# EAGLE design source_eagle (EAGLE 9.4.1)
AUTHOR: ladyada
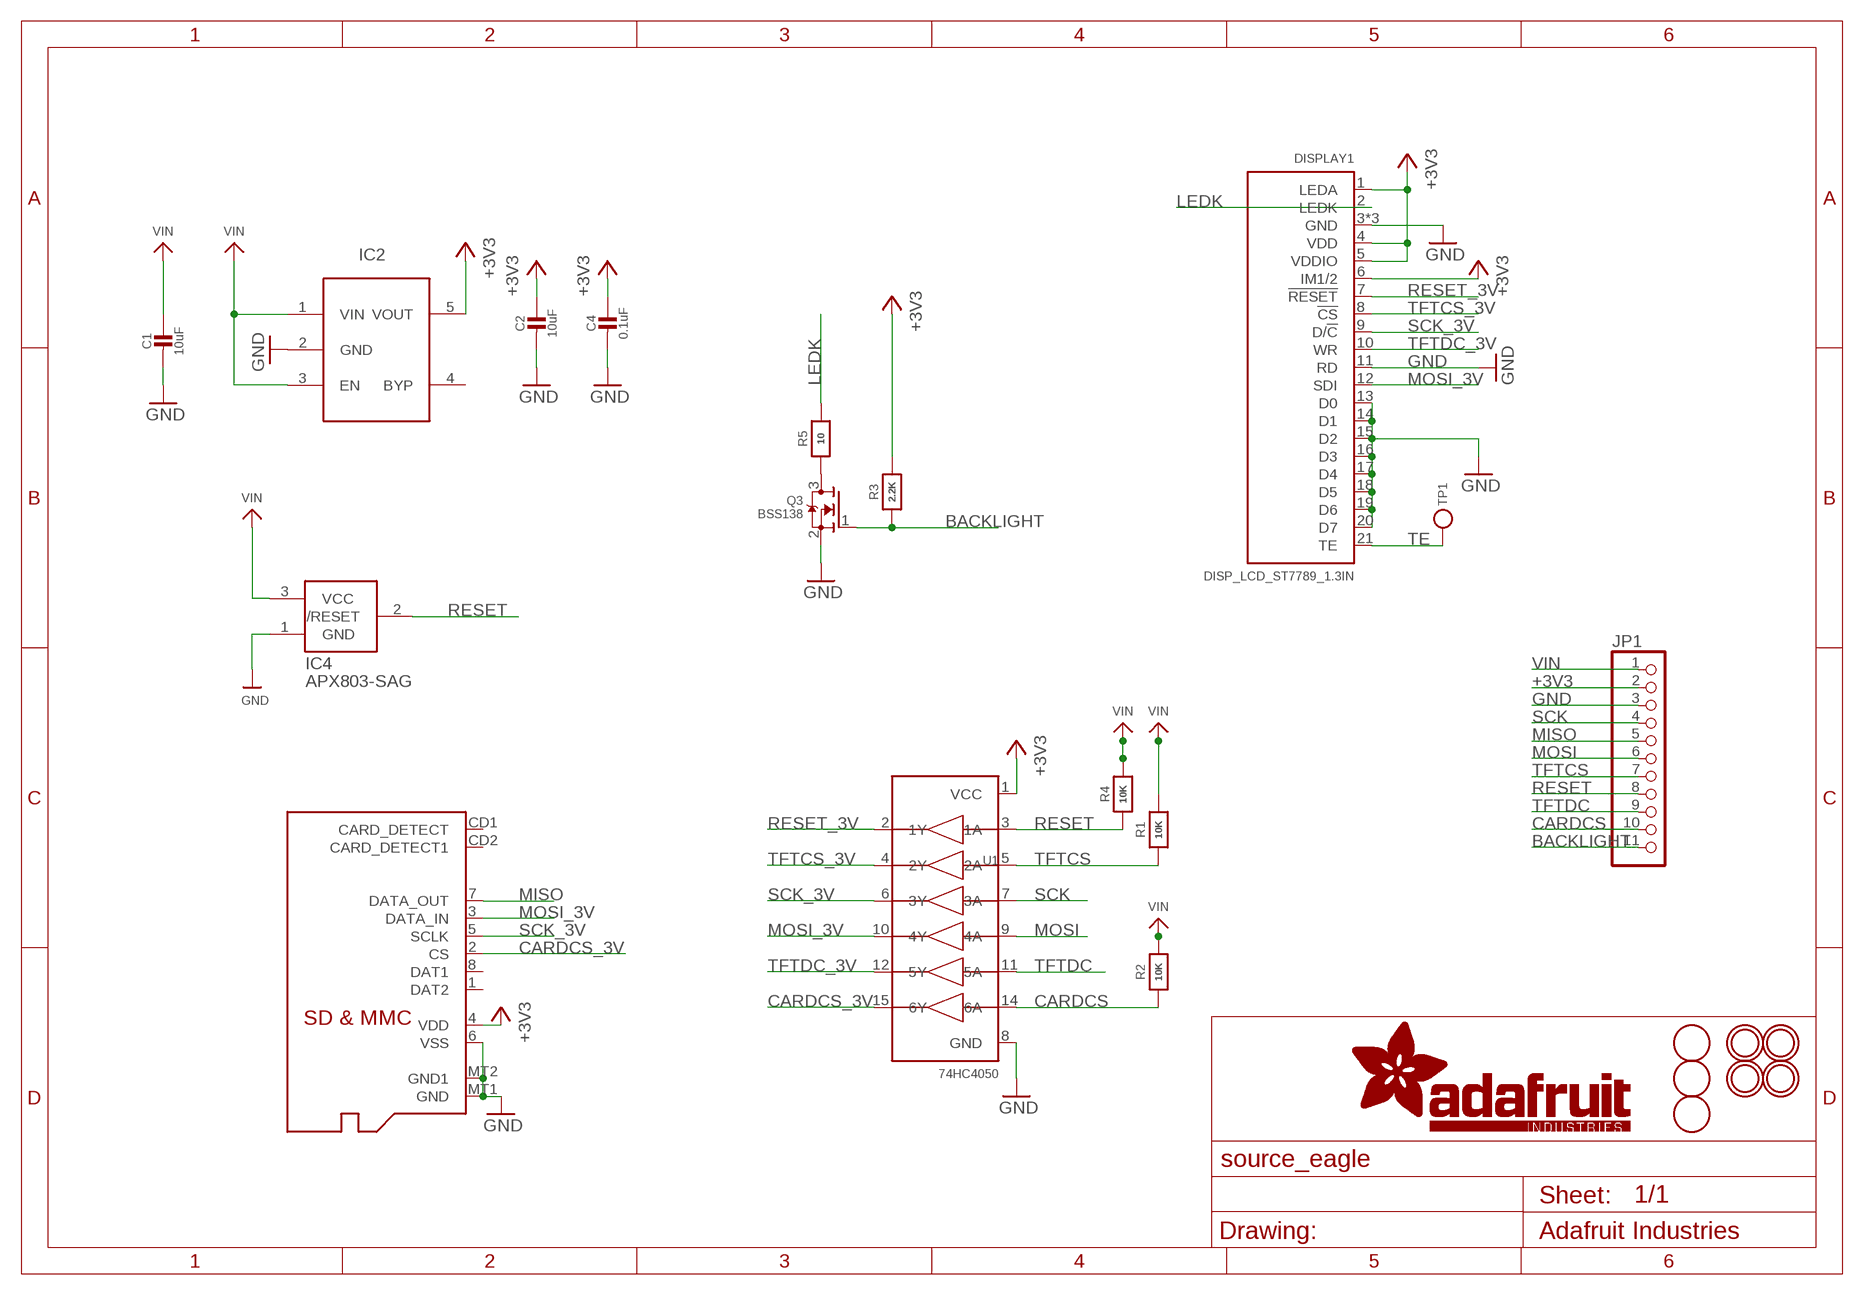
[diagram p0: schematic, sheet 1]

## Parts
C1  10uF  CAP_CERAMIC0805-NOOUTLINE  [0805-NO]
C2  10uF  CAP_CERAMIC0805-NOOUTLINE  [0805-NO]
C4  0.1uF  CAP_CERAMIC0603_NO  [0603-NO]
DISPLAY1  DISP_LCD_ST7789_1.3IN  [TFT_1.3IN_240X240_24P]
IC2  AP2112K-3.3  LP298XS  [SOT23-5L]
IC4  APX803-SAG  AXP083-SAG  [SOT23]
JP1  HEADER-1X1176MIL  [1X11_ROUND_76]
Q2  MICROSD  [MICROSD]
Q3  BSS138  MOSFET-NWIDE  [SOT23-WIDE]
R1  10K  RESISTOR_0603_NOOUT  [0603-NO]
R2  10K  RESISTOR_0603_NOOUT  [0603-NO]
R3  2.2K  RESISTOR_0603_NOOUT  [0603-NO]
R4  10K  RESISTOR_0603_NOOUT  [0603-NO]
R5  10  RESISTOR_0603_NOOUT  [0603-NO]
TP1  TESTPOINTROUND1.5MM  [TESTPOINT_ROUND_1.5MM]
U1  74HC4050  74HC4050DTSSOP  [TSSOP16]
U$3  FIDUCIAL  [FIDUCIAL_1MM]
U$4  FIDUCIAL  [FIDUCIAL_1MM]
U$5  FIDUCIAL  [FIDUCIAL_1MM]
U$7  MOUNTINGHOLE2.5  [MOUNTINGHOLE_2.5_PLATED]
U$8  MOUNTINGHOLE2.5  [MOUNTINGHOLE_2.5_PLATED]
U$9  MOUNTINGHOLE2.5  [MOUNTINGHOLE_2.5_PLATED]
U$10  MOUNTINGHOLE2.5  [MOUNTINGHOLE_2.5_PLATED]

## Nets
+3V3 [power]: C2.1 C4.1 DISPLAY1.1(LEDA) DISPLAY1.4(VDD) DISPLAY1.5(VDDIO) DISPLAY1.6(IM1/2) IC2.5(VOUT) JP1.2 Q2.4(VDD) R3.2 U1.1(VCC)
BACKLIGHT: JP1.11 Q3.1(G) R3.1
CARDCS: JP1.10 R2.1 U1.14(6A)
CARDCS_3V: Q2.2(CS) U1.15(6Y)
GND: C1.2 C2.2 C4.2 DISPLAY1.3(GND) DISPLAY1.11(RD) DISPLAY1.13(D0) DISPLAY1.14(D1) DISPLAY1.15(D2) DISPLAY1.16(D3) DISPLAY1.17(D4) DISPLAY1.18(D5) DISPLAY1.19(D6) DISPLAY1.20(D7) DISPLAY1.23(GND) DISPLAY1.24(GND) IC2.2(GND) IC4.1(GND) JP1.3 Q2.6(VSS) Q2.MT1(GND) Q2.MT2(GND1) Q3.2(S) U1.8(GND)
LEDK: DISPLAY1.2(LEDK) R5.2
MISO: JP1.5 Q2.7(DATA_OUT)
MOSI: JP1.6 U1.9(4A)
MOSI_3V: DISPLAY1.12(SDI) Q2.3(DATA_IN) U1.10(4Y)
N$1: Q3.3(D) R5.1
RESET: IC4.2(/RESET) JP1.8 R4.1 U1.3(1A)
RESET_3V: DISPLAY1.7(!RESET) U1.2(1Y)
SCK: JP1.4 U1.7(3A)
SCK_3V: DISPLAY1.9(D/!C) Q2.5(SCLK) U1.6(3Y)
TE: DISPLAY1.21(TE) TP1.P$1
TFTCS: JP1.7 R1.1 U1.5(2A)
TFTCS_3V: DISPLAY1.8(!CS) U1.4(2Y)
TFTDC: JP1.9 U1.11(5A)
TFTDC_3V: DISPLAY1.10(WR) U1.12(5Y)
VIN [power]: C1.1 IC2.1(VIN) IC2.3(EN) IC4.3(VCC) JP1.1 R1.2 R2.2 R4.2
Unconnected: IC2.4(BYP) Q2.1(DAT2) Q2.8(DAT1) Q2.CD1(CARD_DETECT) Q2.CD2(CARD_DETECT1)

## Library data of the parts
C1 C2 C4 = microbuilder:CAP_CERAMIC: Ceramic Capacitors For new designs, use the packages preceded by an '_' character since they are more reliable: The following footprints should be used on most boards: _0402 - Standard footprint for regular board layouts _0603 - Standard footprint for regular board layouts _0805 - Standard footprint for regular board layouts _1206 - Standard footprint for regular board layouts For extremely tight-pitch boards where space is at a premium, the following 'micro-pitch' footprints can be used (smaller pads, no silkscreen outline, etc.): _0402MP - Micro-pitch footprint for very dense/compact boards _0603MP - Micro-pitch footprint for very dense/compact boards _0805MP - Micro-pitch footprint for very dense/compact boards _1206MP - Micro-pitch footprint for very dense/compact boards
DISPLAY1 = microbuilder:DISP_LCD_ST7789_1.3IN
IC2 = adafruit:LP298X
IC4 = adafruit:AXP083
JP1 = microbuilder:HEADER-1X11
Q2 = adafruit:MICROSD: Micro-SD / Transflash card holder with SPI pinout For the 3M # 2908-05WB-MG and/or 4UCON #19656 push-push type
Q3 = microbuilder:MOSFET-N: N-Channel Mosfet LEGEND VDS: Voltage Drain-Source ID: Drain Current RDS(ON): Drain-Source On-State Resistance VGS(TH): Gate-Source Threshold Voltage CISS: Drain-Source Input Capacitance SOT-23 Name VDS ID RDS(ON) VGS(TH) CISS Order Number 2N7002E 60V 260mA 2.5 Ohm 2.5V @ 250uA 26.7pF @ 25V 2N7002ET1GOSTR-ND BSH103 30V 850mA 400 mOhm 400mV @ 1mA 83pF @ 24V BSH103,235-ND BSS138 60V 320mA 1.6 Ohm 1.5V @ 250uA 50pF @ 10V Mouser: 771-BSS138PW115 DMN2075U-7 20V 4.2A 38 mOhm 1V @ 250 uA 594.3pF @ 10V DMN2075U-7DICT-ND * BSS138 good choice for I2C level-shifting POWERPAK 1212-8 Name VDS ID RDS(ON) VGS(TH) CISS Order Number Si7308DN 60V 6A 58 mOhm 3V @ 250uA 665pF @ 15V SI7308DN-T1-E3CT-ND
R1-R5 = microbuilder:RESISTOR: Resistors For new designs, use the packages preceded by an '_' character since they are more reliable: The following footprints should be used on most boards: _0402 - Standard footprint for regular board layouts _0603 - Standard footprint for regular board layouts _0805 - Standard footprint for regular board layouts _1206 - Standard footprint for regular board layouts For extremely tight-pitch boards where space is at a premium, the following 'micro-pitch' footprints can be used (smaller pads, no silkscreen outline, etc.): _0402MP - Micro-pitch footprint for very dense/compact boards _0603MP - Micro-pitch footprint for very dense/compact boards _0805MP - Micro-pitch footprint for very dense/compact boards _1206MP - Micro-pitch footprint for very dense/compact boards
TP1 = microbuilder:TESTPOINT: Test Point Various test points for characterisation and PCB testing TESTPOINT_SMT - Compact Surface Mount Test Point [Digikey: 5016KTR-ND]
U1 = microbuilder:74HC4050D: 6-channel level shifter 74HC4050D - 2V-6V Supply SOIC16 Digikey: 74HC4050D,653-ND Mouser: 771-74HC4050D-T TSSOP16 Digikey: 296-9215-1-ND Mouser:
U$3-U$5 = adafruit:FIDUCIAL: For use by pick and place machines to calibrate the vision/machine, 1mm By microbuilder.eu
U$7-U$10 = microbuilder:MOUNTINGHOLE: Mounting Hole For #2 screws (0.086"/2.18mm width, 0.094"/2.4mm hole) use 2.5mm; BOM: EXCLUDE

## Net classes
1 power: width 0.254 mm

## Board
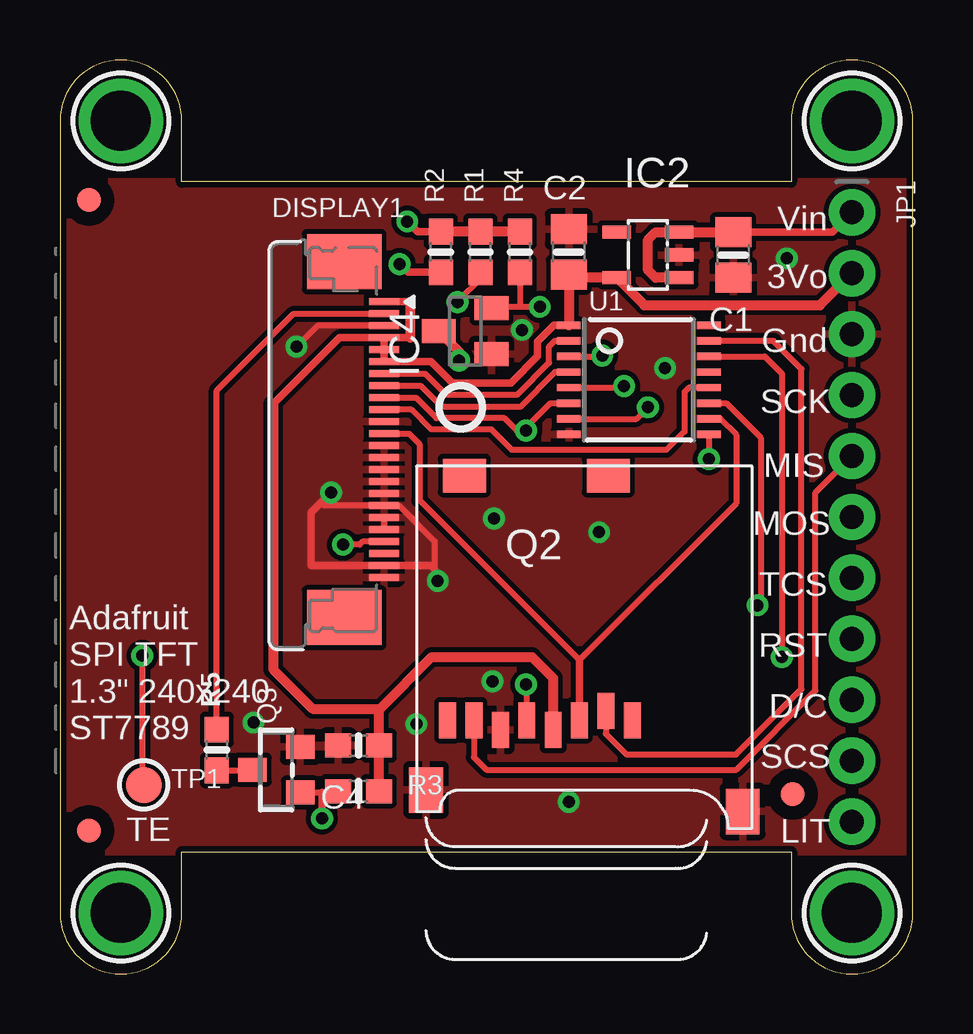
[diagram p1: board, top side]
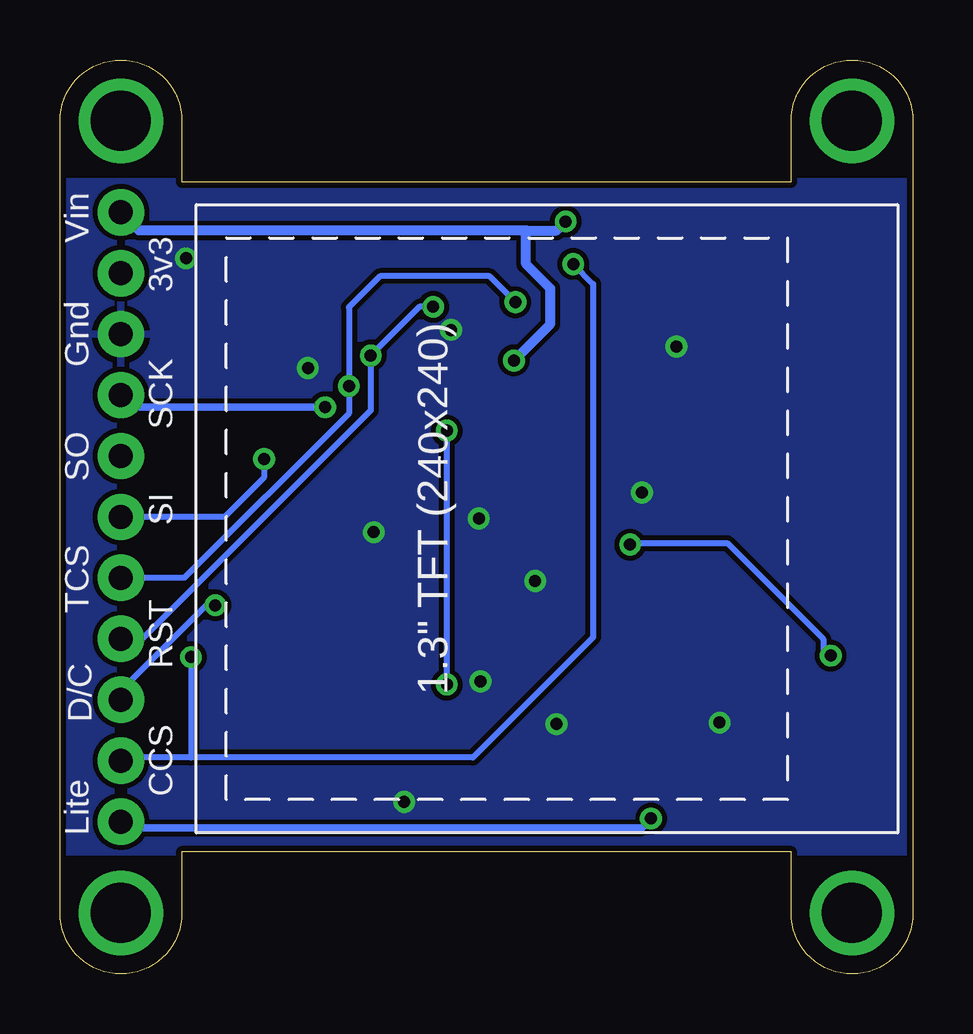
[diagram p2: board, bottom side, seen from below]

Size 35.56 x 38.1 mm. Coordinates in mm from the lower left corner, seen from the top.
Outline: 30.48,5.08 30.48,2.54 arc90 33.02,0 arc90 35.56,2.54 35.56,35.56 arc90 33.02,38.1 arc90 30.48,35.56 30.48,33.02 5.08,33.02 5.08,35.56 arc90 2.54,38.1 arc90 0,35.56 0,2.54 arc90 2.54,0 arc90 5.08,2.54 5.08,5.08 30.48,5.08
Copper layers (1*16): Top 0.035mm / dielectric 1.5mm / Bottom 0.035mm
Design rules "adafruit *": minimum track width 8mil, minimum drill 15.5mil, track to track 8mil, track to pad 8mil, pad to pad 8mil, via to via 8mil, smd to smd 8mil, copper to edge 10mil, drill to drill 8mil, minimum pad ring 10mil, minimum via ring 8mil, stop-mask expansion 2mil, vias tented up to drill 20mil, thermal gap 10mil

### Footprints (pad centres in the part's own frame; a part is rotated, then mirrored left to right if it is on the bottom)
0805-NO = smd 1.24 x 1.5: 1 -0.95,0; 2 0.95,0
0603-NO = smd 1.075 x 1: 1 -0.85,0; 2 0.85,0
TFT_1.3IN_240X240_24P = smd 0.28 x 1.25: 1 4.55,13.378; 2 5.05,13.378; 3 5.55,13.378; 4 6.05,13.378; 5 6.55,13.378; 6 7.05,13.378; 7 7.55,13.378; 8 8.05,13.378; 9 8.55,13.378; 10 9.05,13.378; 11 9.55,13.378; 12 10.05,13.378; 13 10.55,13.378; 14 11.05,13.378; 15 11.55,13.378; 16 12.05,13.378; 17 12.55,13.378; 18 13.05,13.378; 19 13.55,13.378; 20 14.05,13.378; 21 14.55,13.378; 22 15.05,13.378; 23 15.55,13.378; 24 16.05,13.378 | smd 2.3 x 3.1: MNT1 2.88,11.722; MNT2 17.72,11.722
SOT23-5L = smd 0.55 x 1.2: 1 -0.95,-1.3; 2 0,-1.3; 3 0.95,-1.3; 4 0.95,1.3; 5 -0.95,1.3
SOT23 = smd 1 x 1.4: 1 -0.95,-1.1; 2 0.95,-1.1; 3 0,1.1
1X11_ROUND_76 = drill 1 pad 1.93: 1 -12.7,0; 2 -10.16,0; 3 -7.62,0; 4 -5.08,0; 5 -2.54,0; 6 0,0; 7 2.54,0; 8 5.08,0; 9 7.62,0; 10 10.16,0; 11 12.7,0
MICROSD = smd 0.7 x 1.5: 1 9,-10.64; 2 7.9,-10.24; 3 6.8,-10.64; 4 5.7,-11.04; 5 4.6,-10.64; 6 3.5,-11.04; 7 2.4,-10.64; 8 1.3,-10.64 | smd 1.8 x 1.4: CD1 2,-0.44; CD2 8,-0.44 | smd 1.4 x 1.9: MT1 0.4,-13.54; MT2 13.6,-14.44
SOT23-WIDE = smd 1 x 1.2: 1 -0.95,-1; 2 0.95,-1; 3 0,1
TESTPOINT_ROUND_1.5MM = smd 1.5 x 1.5: P$1 0,0
TSSOP16 = smd 0.305 x 0.991: 1 -2.275,-2.918; 2 -1.625,-2.918; 3 -0.975,-2.918; 4 -0.325,-2.918; 5 0.325,-2.918; 6 0.975,-2.918; 7 1.625,-2.918; 8 2.275,-2.918; 9 2.275,2.918; 10 1.625,2.918; 11 0.975,2.918; 12 0.325,2.918; 13 -0.325,2.918; 14 -0.975,2.918; 15 -1.625,2.918; 16 -2.275,2.918
FIDUCIAL_1MM = smd 1 x 1: 1 0,0
MOUNTINGHOLE_2.5_PLATED = drill 2.5 pad 3.2: P$1 0,0

### Placement (x,y rotation side)
C1  28.07,29.97 270 top
C2  21.21,30.1 90 top
C4  12.45,9.53 180 top
DISPLAY1  0.13,32.58 270 top
IC2  24.51,29.97 90 top
IC4  16.89,26.8 90 top
JP1  33.02,19.05 270 top
Q2  14.86,21.21 0 top
Q3  9.02,8.51 90 top
R1  17.53,30.1 90 top
R2  15.88,30.1 90 top
R3  12.45,7.62 0 top
R4  19.18,30.1 90 top
R5  6.54,9.33 90 top
TP1  3.49,7.87 0 top
U1  24.13,24.77 270 top
U$2  [PCBFEAT-REV-040]  16.7,23.62 0 top
U$3  1.21,5.97 0 top
U$4  1.21,32.26 0 top
U$5  30.54,7.49 0 top
U$7  2.54,35.56 0 top
U$8  2.54,2.54 0 top
U$9  33.02,35.56 0 top
U$10  33.02,2.54 0 top

### Tracks (layer width: path | path; a pad name or v marks a point on that pad's centre or on a via)
+3V3
  Top 0.305: 14.61,28.02 DISPLAY1.1 | DISPLAY1.4 14.61,26.52 | 13.3,11.01 13.34,11.05 | DISPLAY1.4 11.67,26.52 8.89,23.75 | U1.1 20.59,27.04 19.9,26.36 19.9,25.75 18.79,24.64 16.36,24.64 15.47,25.52 DISPLAY1.6 DISPLAY1.5 DISPLAY1.4
  Top 0.406: R3.2 C4.1 13.3,11.01 | Q2.4 20.56,12.33 19.68,13.21 15.49,13.21 13.34,11.05 10.54,11.05 8.89,12.7 8.89,23.75 | U1.1 C2.1 21.34,29.02 IC2.5 24.36,27.88 31.69,27.88 JP1.2 | 14.61,26.52 14.61,28.02
BACKLIGHT  (via drill 0.5)
  Top 0.254: Q3.1 10.92,7.56 11.54,7.56 R3.1
  Top 0.305: v10.92,6.48 10.92,7.56
  Bottom 0.305: v10.92,6.48 11.3,6.1 33.02,6.1 | JP1.11 33.02,6.1 | 33.02,6.1
CARDCS  (via drill 0.5)
  Top 0.254: U1.14 29.38,25.74 30.1,25.02 30.1,13.59 | 30.1,13.72 30.1,13.59 | 30.1,13.59 v30.1,13.21 | 30.1,13.59
  Top 0.305: R2.1 14.5,29.25 v14.16,29.59
  Bottom 0.254: v14.16,29.59 13.34,28.77 13.34,14.03 18.35,9.02 30.1,9.02 | v30.1,13.21 30.1,9.02 | 30.1,9.02 32.89,9.02 JP1.10 | 30.1,9.02
CARDCS_3V
  Top 0.254: Q2.2 22.76,10.01 23.62,9.14 28.18,9.14 30.91,11.87 30.91,25.22 29.74,26.39 U1.15
GND  (via drill 0.5)
  Top 0.254: DISPLAY1.3 10.73,27.02 v9.86,26.15 | DISPLAY1.19 DISPLAY1.20 | 11.34,19.84 11.02,19.52 DISPLAY1.18 14.13,19.52 15.62,18.03 15.62,16.89 15.62,16.45 | 15.62,16.38 v15.75,16.38 15.61,16.52
  Top 0.305: 11.34,19.84 11.3,19.88 v11.3,20.07 10.48,19.24 10.48,17.02 DISPLAY1.23 15.49,17.02 15.62,16.89
  other vias: 8.06,10.48 14.86,10.41 18.03,12.19 30.31,29.83 19.26,26.85 25.23,25.26 18.1,18.99 22.48,18.41 21.21,7.18
  pour Top: 0,5.08 0,33.02 35.56,33.02 35.56,5.08
  pour Bottom: 35.56,5.08 0,5.08 0,33.02 35.56,33.02
LEDK
  Top 0.254: R5.2 6.54,24.32 9.74,27.52 DISPLAY1.2
MISO
  Top 0.254: Q2.7 17.26,9.03 17.78,8.51 28.19,8.51 31.5,11.81 31.5,20.07 32.77,21.34 JP1.5
MOSI  (via drill 0.5)
  Top 0.254: U1.9 27.05,21.59
  Top 0.305: v27.05,21.46 27.05,21.59
  Bottom 0.254: v27.05,21.46 27.05,20.7 28.7,19.05 JP1.6
MOSI_3V
  Top 0.254: DISPLAY1.12 14.56,22.52 14.99,22.1 14.99,19.75 21.66,13.08 28.19,19.62 | U1.10 27.53,23.14 28.19,22.48 28.19,19.62 | 28.19,19.62
  Top 0.305: Q2.3 21.66,13.08
N$1
  Top 0.254: R5.1 7.99,8.48 Q3.3
RESET  (via drill 0.5)
  Top 0.254: U1.3 22.57,25.74 v22.61,25.78 | IC4.2 18.06,27.81 19.18,27.81 | 19.18,27.81 v20,27.81 | R4.1 19.18,27.81
  Bottom 0.254: v22.61,25.78 22.61,23.49 32.13,13.97 JP1.8 | v20,27.81 20.57,27.81 22.38,26
  Bottom 0.305: v22.61,25.78 22.38,26
RESET_3V
  Top 0.254: U1.2 20.62,26.39 20.39,26.16 20.39,25.48 19.05,24.14 16.11,24.14 15.22,25.02 DISPLAY1.7
SCK  (via drill 0.5)
  Top 0.254: U1.7 24.03,23.14 v24.51,23.62
  Bottom 0.305: JP1.4 32.51,23.62 v24.51,23.62
SCK_3V  (via drill 0.5)
  Top 0.254: DISPLAY1.9 14.84,24.02 15.7,23.17 18.53,23.17 19.05,22.65 v19.43,22.65 19.43,22.77 20.45,23.79 U1.6 | Q2.5 19.46,12.04
  Top 0.305: 19.46,12.04 v19.43,12.07
  Bottom 0.254: v19.43,12.07 v19.43,22.65
TE  (via drill 0.5)
  Top 0.254: DISPLAY1.21 12.62,18.02 12.49,17.9 v11.79,17.9 | v3.43,13.27 3.43,7.94 TP1.P$1
  Bottom 0.254: v11.79,17.9 11.73,17.96 7.74,17.96 3.75,13.97 3.75,13.27 v3.43,13.27
TFTCS  (via drill 0.5)
  Top 0.254: U1.5 23.45,24.44 v23.52,24.51 | R1.1 17.53,28.99 16.57,28.04 v16.57,28
  Bottom 0.254: v16.57,28 17.65,29.08 22.23,29.08 23.52,27.79 v23.52,24.51 23.52,23.37 30.37,16.51 JP1.7
TFTCS_3V
  Top 0.254: DISPLAY1.8 15.03,24.52 15.92,23.64 19.19,23.64 20.64,25.09 U1.4
TFTDC  (via drill 0.5)
  Top 0.254: U1.11 27.77,23.79 29.21,22.35 29.21,15.49
  Top 0.305: v29.08,15.37 29.21,15.49
  Bottom 0.254: v29.08,15.37 29.46,15.37 32.54,12.29 32.73,12.1 33.02,11.81 JP1.9
TFTDC_3V
  Top 0.254: U1.12 26.22,24.44 26.04,24.26 26.04,22.61 25.27,21.84 18.84,21.84 17.98,22.7 15.47,22.7 14.65,23.52 DISPLAY1.10
VIN  (via drill 0.5)
  Top 0.305: R2.2 14.9,30.95 v14.48,31.37 | C1.1 32.19,30.92 JP1.1
  Top 0.406: C1.1 IC2.3 24.83,30.92 24.51,30.61 24.51,29.34 24.83,29.02 IC2.1 | R4.2 R1.2 R2.2 | IC4.3 16.64,25.95 v16.64,25.57
  Bottom 0.406: 16.13,30.99 14.86,30.99 v14.48,31.37 | 16.13,30.99 16.13,29.59 15.11,28.58 15.11,27.09 v16.64,25.57 | 16.13,30.99 32.26,30.99 JP1.1

### Text on the board
tPlace: Vin | 3Vo | Gnd | SCK | MIS | MOS | TCS | RST | Adafruit / SPI TFT / 1.3" 240x240 / ST7789 | D/C | SCS | TE | LIT
bPlace: 3v3 | Vin | Gnd | SCK | SO | SI | TCS | RST | D/C | CCS | Lite